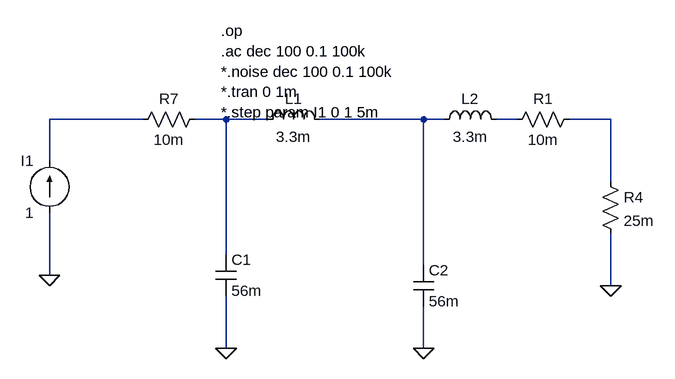
[diagram p0: schematic double_LC_nonideal.asc]
double_LC_nonideal.asc, the LTspice schematic file:
Version 4
SHEET 1 984 680
WIRE 192 48 48 48
WIRE 320 48 272 48
WIRE 384 48 320 48
WIRE 624 48 464 48
WIRE 656 48 624 48
WIRE 768 48 736 48
WIRE 912 48 848 48
WIRE 48 112 48 48
WIRE 912 144 912 48
WIRE 320 256 320 48
WIRE 624 272 624 48
WIRE 48 288 48 192
WIRE 912 304 912 224
WIRE 320 400 320 320
WIRE 624 400 624 336
FLAG 912 304 0
FLAG 624 400 0
FLAG 320 400 0
FLAG 48 288 0
SYMBOL res 896 128 R0
SYMATTR InstName R4
SYMATTR Value 25m
SYMBOL res 288 32 R90
WINDOW 0 0 56 VBottom 2
WINDOW 3 32 56 VTop 2
SYMATTR InstName R7
SYMATTR Value 10m
SYMBOL cap 304 256 R0
SYMATTR InstName C1
SYMATTR Value 56m
SYMATTR SpiceLine Rser=10m
SYMBOL cap 608 272 R0
SYMATTR InstName C2
SYMATTR Value 56m
SYMATTR SpiceLine Rser=10m
SYMBOL ind 368 64 R270
WINDOW 0 32 56 VTop 2
WINDOW 3 5 56 VBottom 2
SYMATTR InstName L1
SYMATTR Value 3.3m
SYMATTR SpiceLine Rser=1.27
SYMBOL ind 640 64 R270
WINDOW 0 32 56 VTop 2
WINDOW 3 5 56 VBottom 2
SYMATTR InstName L2
SYMATTR Value 3.3m
SYMATTR SpiceLine Rser=1.27
SYMBOL current 48 192 R180
WINDOW 0 24 80 Left 2
WINDOW 3 24 0 Left 2
SYMATTR InstName I1
SYMATTR Value 1
SYMATTR Value2 AC 1
SYMBOL res 864 32 R90
WINDOW 0 0 56 VBottom 2
WINDOW 3 32 56 VTop 2
SYMATTR InstName R1
SYMATTR Value 10m
TEXT 312 -88 Left 2 !.op\n.ac dec 100 0.1 100k\n*.noise dec 100 0.1 100k\n*.tran 0 1m\n*.step param I1 0 1 5m

The netlist it stands for:
* double_LC_nonideal.asc
R4 N005 0 25m
R7 N002 N001 10m
C1 N002 0 56m Rser=10m
C2 N003 0 56m Rser=10m
L1 N002 N003 3.3m Rser=1.27
L2 N003 N004 3.3m Rser=1.27
I1 0 N001 1 AC 1
R1 N005 N004 10m
.op
.ac dec 100 0.1 100k
*.noise dec 100 0.1 100k
*.tran 0 1m
*.step param I1 0 1 5m
.backanno
.end